# Altium schematic sheet PIC.SchDoc
size A4; SheetNumber: 1; SheetTotal: 5
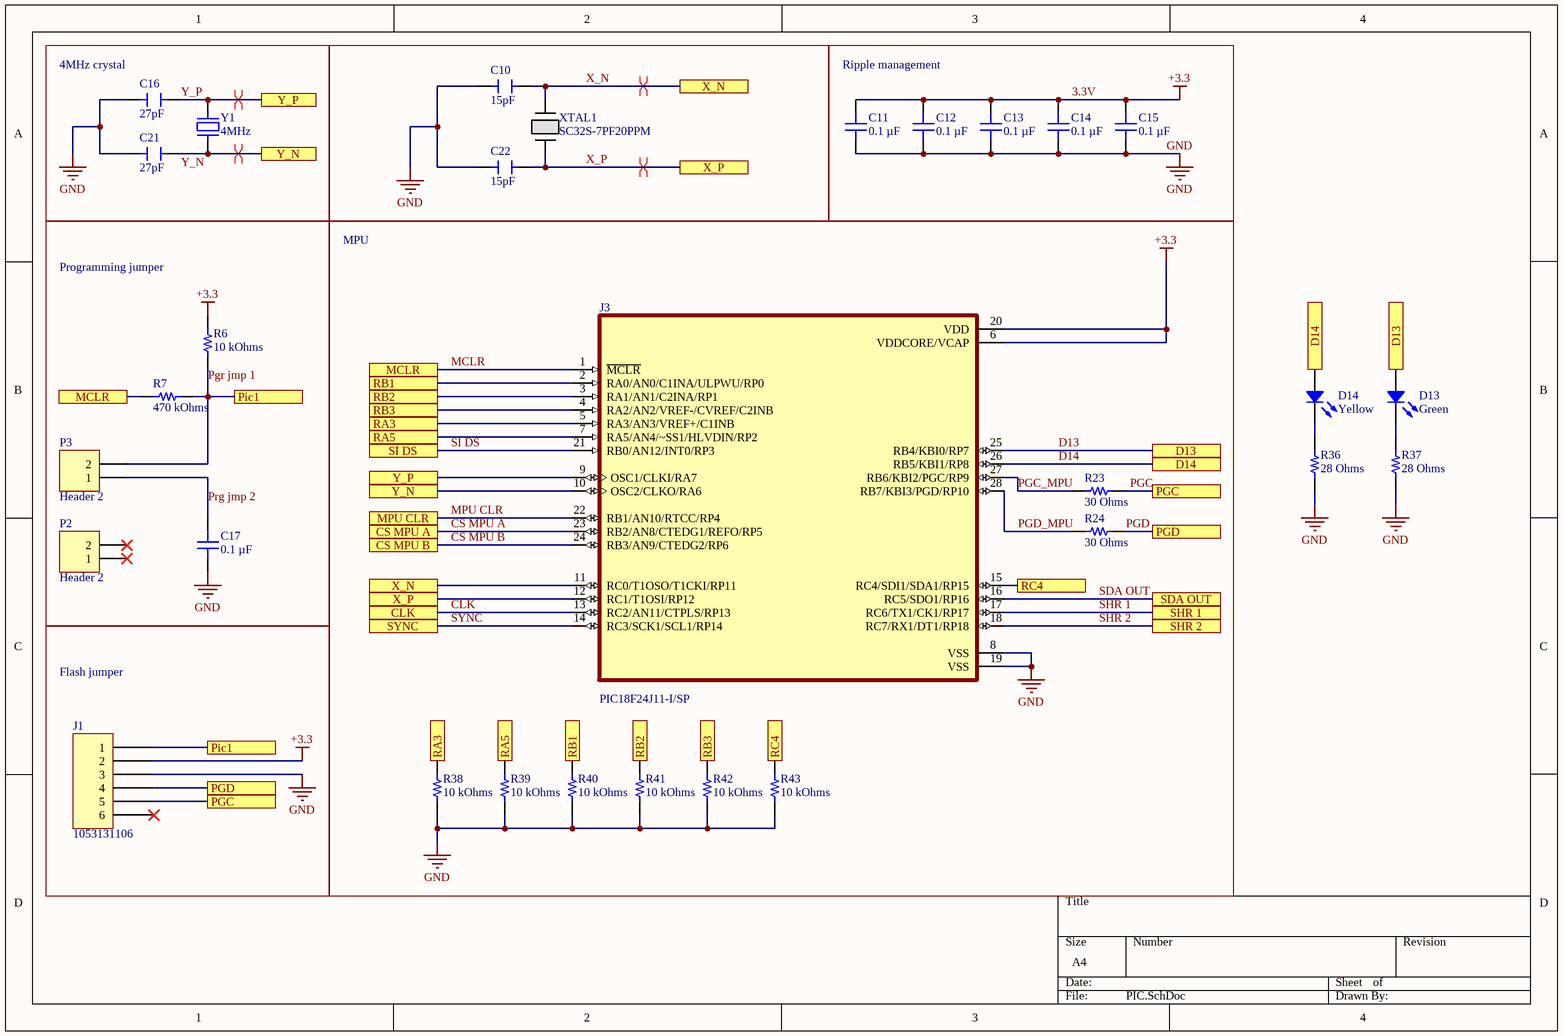
[diagram p0: PIC.SchDoc]

## Parts
C10  15pF  [CAP MICA 27PF]
C11  0.1 µF  [CAP 0805_2012]
C12  0.1 µF  [CAP 0805_2012]
C13  0.1 µF  [CAP 0805_2012]
C14  0.1 µF  [CAP 0805_2012]
C15  0.1 µF  [CAP 0805_2012]
C16  27pF  [CAP MICA 27PF]
C17  0.1 µF  [CAP 0805_2012]
C21  27pF  [CAP MICA 27PF]
C22  15pF  [CAP MICA 27PF]
D13  Green  [LED 1206_3216 GREEN]
D14  Yellow  [LED 0805_2012 YELLOW]
J1  1053131106  [MOLEX 1053131106]
J3  PIC18F24J11-I/SP  [DIP787W45P254L3556H508Q28]
P2  Header 2  [HDR1X2]
P3  Header 2  [HDR1X2]
R6  10 kOhms  [RES 1210_3225]
R7  470 kOhms  [RES 1210_3225]
R23  30 Ohms  [RES 1210_3225]
R24  30 Ohms  [RES 1210_3225]
R36  28 Ohms  [RES 2512_6432]
R37  28 Ohms  [RES 2512_6432]
R38  10 kOhms  [RES 1210_3225]
R39  10 kOhms  [RES 1210_3225]
R40  10 kOhms  [RES 1210_3225]
R41  10 kOhms  [RES 1210_3225]
R42  10 kOhms  [RES 1210_3225]
R43  10 kOhms  [RES 1210_3225]
XTAL1  SC32S-7PF20PPM  [XTAL_SC32S-7PF20PPM_EPS]
Y1  4MHz  [ABRACON ABLS]

## Blocks framed on the sheet
4MHz crystal: C16 C21 Y1
Ripple management: C11-C15
Programming jumper: C17 P2 P3 R6 R7
MPU: J3 R23 R24 R38-R43
Flash jumper: J1

## Ports
CLK, CS MPU A, CS MPU B, D13, D14, MCLR, MPU CLR, PGC, PGD, Pic1, RA3, RA5, RB1, RB2, RB3, RC4, SDA OUT, SHR 1, SHR 2, SI DS, SYNC, X_N, X_P, Y_N, Y_P

## Nets
3.3V: C11.1 C12.2 C13.2 C14.2 C15.2 J1.2 J3.6(VDDCORE/VCAP) J3.20(VDD) R6.2  [also labelled +3.3]
GND: C10.1 C11.2 C12.1 C13.1 C14.1 C15.1 C16.1 C17.1 C21.1 C22.1 J1.3 J3.8(VSS) J3.19(VSS) R36.1 R37.1 R38.2 R39.1 R40.1 R41.1 R42.1 R43.1
CLK: J3.13(RC2/AN11/CTPLS/RP13) ; port CLK
CS MPU A: J3.23(RB2/AN8/CTEDG1/REFO/RP5) ; port CS MPU A
CS MPU B: J3.24(RB3/AN9/CTEDG2/RP6) ; port CS MPU B
D13: D13.1 J3.25(RB4/KBI0/RP7) ; port D13
D14: D14.1 J3.26(RB5/KBI1/RP8) ; port D14
MCLR: J3.1(~{MCLR}) R7.1 ; port MCLR
MPU CLR: J3.22(RB1/AN10/RTCC/RP4) ; port MPU CLR
PGC: J1.5 R23.2 ; port PGC
PGC_MPU: J3.27(RB6/KBI2/PGC/RP9) R23.1
PGD: J1.4 R24.2 ; port PGD
PGD_MPU: J3.28(RB7/KBI3/PGD/RP10) R24.1
Pgr jmp 1: J1.1 P3.2 R6.1 R7.2 ; port Pic1
Prg jmp 2: C17.2 P3.1
RA3: J3.5(RA3/AN3/VREF+/C1INB) R38.1 ; port RA3
RA5: J3.7(RA5/AN4/~SS1/HLVDIN/RP2) R39.2 ; port RA5
RB1: J3.2(RA0/AN0/C1INA/ULPWU/RP0) R40.2 ; port RB1
RB2: J3.3(RA1/AN1/C2INA/RP1) R41.2 ; port RB2
RB3: J3.4(RA2/AN2/VREF-/CVREF/C2INB) R42.2 ; port RB3
RC4: J3.15(RC4/SDI1/SDA1/RP15) R43.2 ; port RC4
SDA OUT: J3.16(RC5/SDO1/RP16) ; port SDA OUT
SHR 1: J3.17(RC6/TX1/CK1/RP17) ; port SHR 1
SHR 2: J3.18(RC7/RX1/DT1/RP18) ; port SHR 2
SI DS: J3.21(RB0/AN12/INT0/RP3) ; port SI DS
SYNC: J3.14(RC3/SCK1/SCL1/RP14) ; port SYNC
X_N: C10.2 J3.11(RC0/T1OSO/T1CKI/RP11) XTAL1.2 ; port X_N
X_P: C22.2 J3.12(RC1/T1OSI/RP12) XTAL1.1 ; port X_P
Y_N: C21.2 J3.10(OSC2/CLKO/RA6) Y1.1 ; port Y_N
Y_P: C16.2 J3.9(OSC1/CLKI/RA7) Y1.2 ; port Y_P
NetD13_2: D13.2 R37.2
NetD14_2: D14.2 R36.2

Not connected (* = marked no-connect by the designer): J1 6*; P2 1* 2*

## Layout directives
differential pair; net class Y_P: Y_P
differential pair; net class Y_N: Y_N
differential pair; net class X_N: X_N
differential pair; net class X_P: X_P

## Library data of the parts
C10 C22 = CAP MICA 10PF: CAP MICA 15PF 5% 500V RADIAL; Supplier 1: Digikey; Value: 15pF; Supplier Part Number 1: 338-2618-ND
C11-C15 C17 = C0805X104K5RAC7210: .100UF 50.0V; manufacturer: KEMET; Temperature Coefficient: X7R; Tolerance: ±10%; Voltage - Rated: 50V; Part Number: C0805X104K5RAC7210; Value: 0.1 µF; Applications: Boardflex Sensitive; Capacitance: 0.1 µF; componentlink1description: Datasheet; componentlink1url: https://connect.kemet.com:7667/gateway/IntelliData-ComponentDocumentation/1.0/download/datasheet/C0805X104K5RAC7210; componentlink2description: DigiKey Link; componentlink2url: https://www.digikey.com/en/products/detail/kemet/C0805X104K5RAC7210/12082600; Device Package: 0805 (2012 Metric); Features: Soft Termination; lastupdated: 9/02/2024 8:14:45 PM; Lifecycle Status: Active; Minimum Order: 1; Mounting Type: Surface Mount, MLCC; Operating Temperature: -55°C ~ 125°C; Package / Case: 0805 (2012 Metric); packaging: TapeAndReel; partid: 48810; Part Status: Active; price: 0.05; series: SMD Comm X7R Flex; Size / Dimension: 0.079" L x 0.049" W (2.00mm x 1.25mm); Supplier 1: DigiKey; Supplier Part Number 1: 399-C0805X104K5RAC7210CT-ND; Thickness (Max): 0.039" (0.98mm)
C16 C21 = CAP MICA 27PF: CAP MICA 27PF 5% 500V RADIAL; Supplier 1: Digikey; Supplier Part Number 1: 338-2623-ND; Value: 27pF
D13 = XZVG60W: LED GREEN CLEAR 2SMD; Manufacturer: SunLED; Configuration: Standard; Current - Test: 20mA; Lens Color: Colorless; Lens Size: 2.00mm x 1.50mm; Lens Style: Rectangle with Flat Top; Millicandela Rating: 118mcd; Viewing Angle: 70°; Voltage - Forward (Vf) (Typ): 2.1V; Wavelength - Dominant: 570nm; Wavelength - Peak: 574nm; Part Number: XZVG60W; Color: Green; ComponentLink1Description: Datasheet; ComponentLink1URL: https://www.sunledusa.com/products/spec/XZVG60W.pdf; ComponentLink2Description: DigiKey Link; ComponentLink2URL: https://www.digikey.com/en/products/detail/sunled/XZVG60W/4902123; Device Package: 1206 (3216 Metric); Height (Max): 1.40mm; LastUpdated: 3/06/2024 7:59:11 PM; Lens Transparency: Clear; Lifecycle Status: Active; Minimum Order: 1; Mounting Type: Surface Mount; Package / Case: 1206 (3216 Metric); Packaging: TapeAndReel; PartId: 1002; Part Status: Active; Price: 0.07; Series: -; Size / Dimension: 3.00mm L x 1.50mm W; Supplier 1: DigiKey; Supplier Part Number 1: 1497-1398-1-ND; Supplier Device Package: 2-SMD; Value: Green
D14 = XZUY54W-1: LED YELLOW CLEAR CHIP SMD; Manufacturer: SunLED; Configuration: Standard; Current - Test: 20mA; Lens Color: Colorless; Lens Size: 1.20mm x 1.25mm; Lens Style: Rectangle with Flat Top; Millicandela Rating: 7mcd; Viewing Angle: 120°; Voltage - Forward (Vf) (Typ): 2.1V; Wavelength - Dominant: 588nm; Wavelength - Peak: 590nm; Part Number: XZUY54W-1; Color: Yellow; ComponentLink1Description: Datasheet; ComponentLink1URL: https://www.sunledusa.com/products/spec/XZUY54W-1.pdf; ComponentLink2Description: DigiKey Link; ComponentLink2URL: https://www.digikey.com/en/products/detail/sunled/XZUY54W-1/4745811; Device Package: 0805 (2012 Metric); Height (Max): 0.75mm; LastUpdated: 3/06/2024 8:01:27 PM; Lens Transparency: Clear; Lifecycle Status: Active; Minimum Order: 1; Mounting Type: Surface Mount; Package / Case: 0805 (2012 Metric); Packaging: TapeAndReel; PartId: 43; Part Status: Active; Price: 0.04; Series: -; Size / Dimension: 2.00mm L x 1.25mm W; Supplier 1: DigiKey; Supplier Part Number 1: 1497-1210-1-ND; Supplier Device Package: Chip LED; Value: Yellow
J1 = 1053131106: CONN HEADER R/A 6POS 2.5MM; Manufacturer: Molex; Contact Length - Post: 0.126" (3.20mm); Number of Positions: 6; Number of Positions Loaded: All; Pitch - Mating: 0.098" (2.50mm); Row Spacing - Mating: -40°C ~ 105°C; Shrouding: Shrouded - 4 Wall; Style: Board to Cable/Wire; Part Number: 1053131106; ComponentLink1Description: Datasheet; ComponentLink1URL: https://www.molex.com/pdm_docs/ps/PS-105300-100-001.pdf; ComponentLink2Description: DigiKey Link; ComponentLink2URL: https://www.digikey.com/en/products/detail/molex/1053131106/7693178; Connector Type: Header; Contact Finish - Mating: Tin; Contact Finish - Post: Tin; Contact Finish Thickness - Mating: 59.0µin (1.50µm); Contact Material: Brass; Contact Shape: Square; Contact Type: Male Pin; Fastening Type: Latch Holder; Features: Board Guide; Insulation Color: Black; Insulation Height: 0.149" (3.78mm); Insulation Material: Liquid Crystal Polymer (LCP); LastUpdated: 11/08/2022 9:49:49 AM; Lifecycle Status: Active; Minimum Order: 1; Mounting Type: Through Hole, Right Angle; Number of Rows: 1; Operating Temperature: -40°C ~ 105°C; Packaging: Tray; PartId: 145; Part Status: Active; Price: 0.75; Series: Nano-Fit 105313; Supplier 1: DigiKey; Supplier Part Number 1: WM16897-ND; Termination: Solder
J3 = PIC18F24J11-I/SP: 28-Pin, 16KB Flash, 4KB RAM, 12 MIPS, nanoWatt | Microchip Technology Inc. PIC18F24J11-I/SP; SnapEDA_Link: https://www.snapeda.com/parts/PIC18F24J11-I/SP/Microchip/view-part/?ref=snap; Package: SPDIP-28 Microchip; Value: *; MF: Microchip; MP: PIC18F24J11-I/SP; Check_prices: https://www.snapeda.com/parts/PIC18F24J11-I/SP/Microchip/view-part/?ref=eda
P2 P3 = Header 2: Header, 2-Pin; LatestRevisionDate: 17-Jul-2002; LatestRevisionNote: Re-released for DXP Platform.; Publisher: Altium Limited
R6 R38-R43 = CRMA1210AF10K0FKEF: CRMA1210 10K 1% EF E3; Manufacturer: Vishay Dale; Power (Watts): 0.35W; Temperature Coefficient: ±100ppm/°C; Part Number: CRMA1210AF10K0FKEF; ComponentLink1Description: Datasheet; ComponentLink1URL: https://www.vishay.com/docs/68043/crma.pdf; ComponentLink2Description: DigiKey Link; ComponentLink2URL: https://www.digikey.com/en/products/detail/vishay-dale/CRMA1210AF10K0FKEF/13998641; Composition: Thick Film; Device Package: 1210 (3225 Metric); Features: Automotive AEC-Q200, Moisture Resistant; Height - Seated (Max): 0.029" (0.74mm); LastUpdated: 3/06/2024 8:18:49 PM; Lifecycle Status: Active; Minimum Order: 1; Number of Terminations: 2; Operating Temperature: -55°C ~ 155°C; Package / Case: 1210 (3225 Metric); Packaging: TapeAndReel; Part Status: Active; Price: 0.17; Ratings: AEC-Q200; Resistance: 10 kOhms; Series: CRMA; Size / Dimension: 0.125" L x 0.100" W (3.18mm x 2.54mm); Supplier 1: DigiKey; Supplier Part Number 1: 541-CRMA1210AF10K0FKEFCT-ND; Supplier Device Package: 1210; Tolerance: ±1%; Value: 10 kOhms
R7 = CRCW1210470KJNEA: RES SMD 470K OHM 5% 1/2W 1210; Manufacturer: Vishay Dale; Power (Watts): 0.5W, 1/2W; Temperature Coefficient: ±200ppm/°C; Part Number: CRCW1210470KJNEA; ComponentLink1Description: Datasheet; ComponentLink1URL: http://www.vishay.com/docs/20035/dcrcwe3.pdf; ComponentLink2Description: DigiKey Link; ComponentLink2URL: https://www.digikey.com/en/products/detail/vishay-dale/CRCW1210470KJNEA/1177238; Composition: Thick Film; Device Package: 1210 (3225 Metric); Features: Automotive AEC-Q200; Height - Seated (Max): 0.024" (0.60mm); LastUpdated: 3/06/2024 8:19:03 PM; Lifecycle Status: Active; Minimum Order: 1; Number of Terminations: 2; Operating Temperature: -55°C ~ 155°C; Package / Case: 1210 (3225 Metric); Packaging: TapeAndReel; Part Status: Active; Price: 0.02; Ratings: AEC-Q200; Resistance: 470 kOhms; Series: D/CRCW e3; Size / Dimension: 0.126" L x 0.098" W (3.20mm x 2.50mm); Supplier 1: DigiKey; Supplier Part Number 1: 541-470KVCT-ND; Supplier Device Package: 1210; Tolerance: ±5%; Value: 470 kOhms
R23 R24 = MP30R00: MP30R00 0.1% BULK; Manufacturer: Vishay Foil Resistors (Division of Vishay Precision Group); Power (Watts): 0.1W, 1/10W; Temperature Coefficient: ±10ppm/°C; Part Number: MP30R00; ComponentLink1Description: Datasheet; ComponentLink1URL: https://media.digikey.com/pdf/Data%20Sheets/Vishay%20Resistors/MP,%20MQ_Series.pdf; ComponentLink2Description: DigiKey Link; ComponentLink2URL: https://www.digikey.com/en/products/detail/vishay-foil-resistors-division-of-vishay-precision-group/MP30R00/8580916; Composition: Metal Foil; Device Package: 1210 (3225 Metric); Height - Seated (Max): 0.087" (2.20mm); LastUpdated: 3/06/2024 8:18:48 PM; Lifecycle Status: Active; Minimum Order: 1; Number of Terminations: 2; Operating Temperature: -65°C ~ 175°C; Package / Case: 1210 (3225 Metric); Packaging: Bulk; Part Status: Active; Price: 4.65; Resistance: 30 Ohms; Series: MP; Size / Dimension: 0.126" L x 0.098" W (3.20mm x 2.50mm); Supplier 1: DigiKey; Supplier Part Number 1: MP30R00-ND; Supplier Device Package: 2-SMD; Tolerance: ±0.1%; Value: 30 Ohms
R36 R37 = RK73H3ATTE28R0F: RES 28 OHM 1% 1W 2512; manufacturer: KOA Speer Electronics, Inc.; Temperature Coefficient: ±100ppm/°C; Part Number: RK73H3ATTE28R0F; componentlink1description: Datasheet; componentlink1url: http://www.koaspeer.com/catimages/Products/RK73H/RK73H.pdf; componentlink2description: DigiKey Link; componentlink2url: http://digikey.com/product-detail/en/koa-speer-electronics-inc/RK73H3ATTE28R0F/2019-RK73H3ATTE28R0FCT-ND/10425047; Composition: Thick Film; Device Package: 2512 (6432 Metric); Features: Automotive AEC-Q200, Moisture Resistant; Height - Seated (Max): 0.028" (0.70mm); lastupdated: 11/04/2023 8:12:36 PM; Lifecycle Status: Active; Minimum Order: 1; Number of Terminations: 2; Operating Temperature: -55°C ~ 155°C; Package / Case: 2512 (6432 Metric); packaging: TapeAndReel; Part Status: Active; Power (Watts): 1W; price: 0.05; Ratings: AEC-Q200; Resistance: 28 Ohms; series: RK73H; Size / Dimension: 0.248" L x 0.122" W (6.30mm x 3.10mm); Supplier 1: DigiKey; Supplier Part Number 1: 2019-RK73H3ATTE28R0FCT-ND; Supplier Device Package: 2512; Tolerance: ±1%; value: 28 Ohms
XTAL1 = SC32S-7PF20PPM: No Description Available; Mfr_Name: Epson
Y1 = ABLS-4.000MHZ-20-D-4-H-T: CRYSTAL 4.0000MHZ 20PF SMD; Manufacturer: Abracon LLC; ESR (Equivalent Series Resistance): 180 Ohms; Frequency Stability: ±35ppm; Frequency Tolerance: ±30ppm; Operating Mode: Fundamental; Part Number: ABLS-4.000MHZ-20-D-4-H-T; ComponentLink1Description: Datasheet; ComponentLink1URL: https://abracon.com/Resonators/abls.pdf; ComponentLink2Description: DigiKey Link; ComponentLink2URL: http://digikey.com/product-detail/en/abracon-llc/ABLS-4.000MHZ-20-D-4-H-T/535-14920-1-ND/9997997; Frequency: 4MHz; Height - Seated (Max): 0.165" (4.20mm); LastUpdated: 8/02/2024 9:34:21 PM; Lifecycle Status: Active; Load Capacitance: 20pF; Minimum Order: 1; Mounting Type: Surface Mount; Operating Temperature: -40°C ~ 85°C; Package / Case: HC-49/US; Packaging: TapeAndReel; PartId: 85; Part Status: Active; Price: 0.29; Series: ABLS; Size / Dimension: 0.449" L x 0.185" W (11.40mm x 4.70mm); Supplier 1: DigiKey; Supplier Part Number 1: 535-14920-1-ND; Type: MHz Crystal; Value: 4MHz